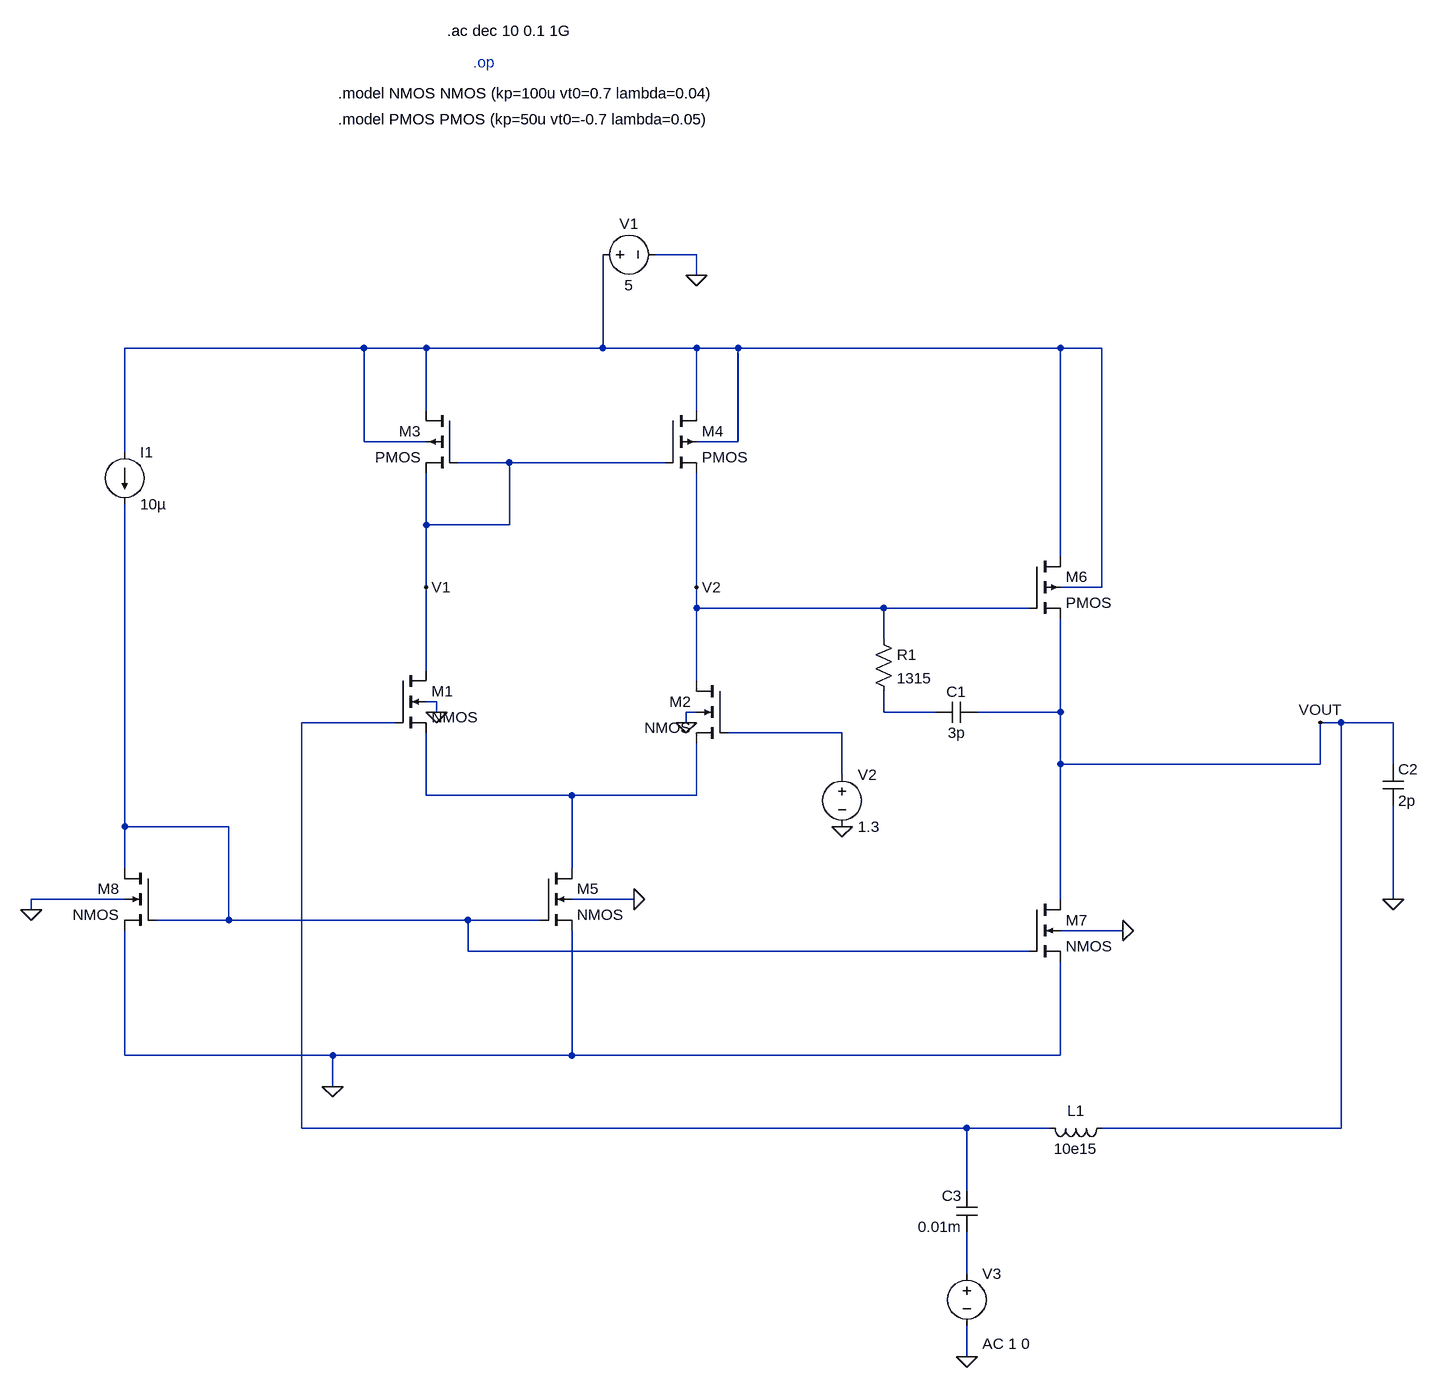
[diagram p0: schematic Draft1_234.asc]
Draft1_234.asc, the LTspice schematic file:
Version 4
SHEET 1 1720 1428
WIRE 480 -464 416 -464
WIRE 480 -432 480 -464
WIRE -32 -320 -400 -320
WIRE 64 -320 -32 -320
WIRE 336 -320 336 -464
WIRE 336 -320 64 -320
WIRE 480 -320 336 -320
WIRE 544 -320 480 -320
WIRE 1040 -320 544 -320
WIRE 1104 -320 1040 -320
WIRE 64 -224 64 -320
WIRE 480 -224 480 -320
WIRE -32 -176 -32 -320
WIRE 64 -176 -32 -176
WIRE 544 -176 544 -320
WIRE 544 -176 480 -176
WIRE -400 -160 -400 -320
WIRE 192 -144 112 -144
WIRE 432 -144 192 -144
WIRE 64 -48 64 -128
WIRE 192 -48 192 -144
WIRE 192 -48 64 -48
WIRE 1040 0 1040 -320
WIRE 64 48 64 -48
WIRE 480 48 480 -128
WIRE 1104 48 1104 -320
WIRE 1104 48 1040 48
WIRE 480 80 480 48
WIRE 768 80 480 80
WIRE 992 80 768 80
WIRE 768 128 768 80
WIRE 64 176 64 48
WIRE 480 192 480 80
WIRE 80 224 64 224
WIRE 80 240 80 224
WIRE 480 240 464 240
WIRE 768 240 768 208
WIRE 848 240 768 240
WIRE 1040 240 1040 96
WIRE 1040 240 912 240
WIRE 16 256 -128 256
WIRE 464 256 464 240
WIRE 1472 256 1440 256
WIRE 1552 256 1472 256
WIRE 704 272 528 272
WIRE 1040 320 1040 240
WIRE 1440 320 1440 256
WIRE 1440 320 1040 320
WIRE 1552 320 1552 256
WIRE 704 336 704 272
WIRE 64 368 64 272
WIRE 288 368 64 368
WIRE 480 368 480 288
WIRE 480 368 288 368
WIRE -400 416 -400 -80
WIRE -240 416 -400 416
WIRE -400 480 -400 416
WIRE 288 480 288 368
WIRE -400 528 -544 528
WIRE 384 528 288 528
WIRE 1040 528 1040 320
WIRE 1552 528 1552 384
WIRE -544 544 -544 528
WIRE -240 560 -240 416
WIRE -240 560 -352 560
WIRE 128 560 -240 560
WIRE 240 560 128 560
WIRE 1136 576 1040 576
WIRE 128 608 128 560
WIRE 992 608 128 608
WIRE -400 768 -400 576
WIRE -80 768 -400 768
WIRE 288 768 288 576
WIRE 288 768 -80 768
WIRE 1040 768 1040 624
WIRE 1040 768 288 768
WIRE -80 816 -80 768
WIRE -128 880 -128 256
WIRE 896 880 -128 880
WIRE 1024 880 896 880
WIRE 1472 880 1472 256
WIRE 1472 880 1104 880
WIRE 896 976 896 880
WIRE 896 1104 896 1040
WIRE 896 1232 896 1184
FLAG 480 -432 0
FLAG -80 816 0
FLAG -544 544 0
FLAG 384 528 0
FLAG 80 240 0
FLAG 464 256 0
FLAG 704 416 0
FLAG 64 48 V1
FLAG 480 48 V2
FLAG 1136 576 0
FLAG 1552 528 0
FLAG 1440 256 VOUT
FLAG 896 1232 0
SYMBOL nmos4 16 176 R0
SYMATTR InstName M1
SYMATTR Value2 l=0.5u w=30u
SYMBOL nmos4 528 192 M0
SYMATTR InstName M2
SYMATTR Value2 l=0.5u w=30u
SYMBOL pmos4 112 -224 M0
SYMATTR InstName M3
SYMATTR Value2 l=2u w=4u
SYMBOL pmos4 432 -224 R0
SYMATTR InstName M4
SYMATTR Value2 l=2u w=4u
SYMBOL nmos4 240 480 R0
SYMATTR InstName M5
SYMATTR Value2 l=0.5u w=16u
SYMBOL nmos4 -352 480 M0
SYMATTR InstName M8
SYMATTR Value2 l=2u w=8u
SYMBOL current -400 -160 R0
WINDOW 123 0 0 Left 0
WINDOW 39 0 0 Left 0
SYMATTR InstName I1
SYMATTR Value 10µ
SYMBOL voltage 320 -464 M90
WINDOW 0 -32 56 VBottom 2
WINDOW 3 32 56 VTop 2
WINDOW 123 0 0 Left 0
WINDOW 39 0 0 Left 0
SYMATTR InstName V1
SYMATTR Value 5
SYMBOL voltage 704 320 R0
WINDOW 123 24 124 Left 2
WINDOW 39 0 0 Left 0
SYMATTR InstName V2
SYMATTR Value 1.3
SYMBOL nmos4 992 528 R0
SYMATTR InstName M7
SYMATTR Value2 l=1u w=32u
SYMBOL cap 1536 320 R0
SYMATTR InstName C2
SYMATTR Value 2p
SYMBOL pmos4 992 0 R0
SYMATTR InstName M6
SYMATTR Value2 l=0.5u w=30u
SYMBOL res 752 112 R0
SYMATTR InstName R1
SYMATTR Value 1315
SYMBOL cap 912 224 R90
WINDOW 0 0 32 VBottom 2
WINDOW 3 32 32 VTop 2
SYMATTR InstName C1
SYMATTR Value 3p
SYMBOL ind 1120 864 R90
WINDOW 0 5 56 VBottom 2
WINDOW 3 32 56 VTop 2
SYMATTR InstName L1
SYMATTR Value 10e15
SYMBOL cap 912 1040 R180
WINDOW 0 24 56 Left 2
WINDOW 3 24 8 Left 2
SYMATTR InstName C3
SYMATTR Value 0.01m
SYMBOL voltage 896 1088 R0
WINDOW 123 24 124 Left 2
WINDOW 39 0 0 Left 0
SYMATTR Value2 AC 1 0
SYMATTR InstName V3
SYMATTR Value ""
TEXT 136 -760 Left 2 ;.op
TEXT -72 -712 Left 2 !.model NMOS NMOS (kp=100u vt0=0.7 lambda=0.04)
TEXT -72 -672 Left 2 !.model PMOS PMOS (kp=50u vt0=-0.7 lambda=0.05)
TEXT 96 -808 Left 2 !.ac dec 10 0.1 1G

The netlist it stands for:
* Draft1_234.asc
M1 V1 N003 N005 0 NMOS l=0.5u w=30u
M2 V2 N004 N005 0 NMOS l=0.5u w=30u
M3 N001 V1 V1 N001 PMOS l=2u w=4u
M4 N001 V1 V2 N001 PMOS l=2u w=4u
M5 N005 N006 0 0 NMOS l=0.5u w=16u
M8 N006 N006 0 0 NMOS l=2u w=8u
I1 N001 N006 10µ
V1 N001 0 5
V2 N004 0 1.3
M7 VOUT N006 0 0 NMOS l=1u w=32u
C2 VOUT 0 2p
M6 N001 V2 VOUT N001 PMOS l=0.5u w=30u
R1 V2 N002 1315
C1 VOUT N002 3p
L1 VOUT N003 10e15
C3 N007 N003 0.01m
V3 N007 0 AC 1 0
.model NMOS NMOS
.model PMOS PMOS
.lib standard.mos
* .op
.model NMOS NMOS (kp=100u vt0=0.7 lambda=0.04)
.model PMOS PMOS (kp=50u vt0=-0.7 lambda=0.05)
.ac dec 10 0.1 1G
.backanno
.end